# EAGLE design I2c Digipot (EAGLE 6.2)
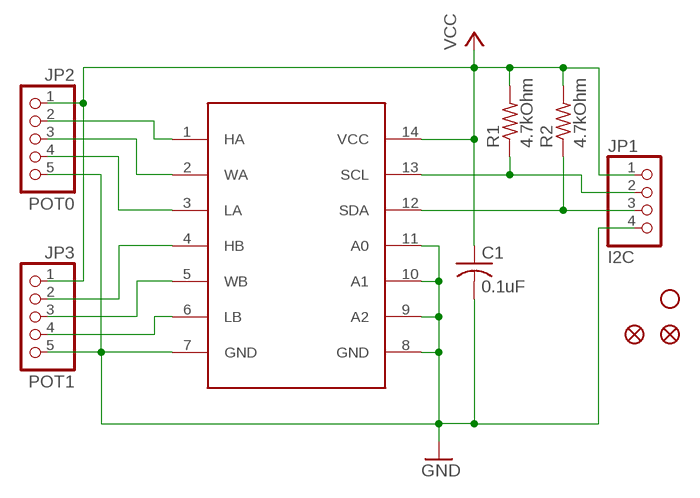
[diagram p0: schematic, sheet 1]

## Parts
C1  0.1uF  C-USC1206  [C1206]
JP1  I2C  PINHD-1X4  [1X04]
JP2  POT0  PINHD-1X5  [1X05]
JP3  POT1  PINHD-1X5  [1X05]
JP5  STAND-OFF  [STAND-OFF]
JP6  FIDUCIAL1X2  [FIDUCIAL-1X2]
JP7  FIDUCIAL1X2  [FIDUCIAL-1X2]
R1  4.7kOhm  R-US_R1206  [R1206]
R2  4.7kOhm  R-US_R1206  [R1206]
U1  MAX5387  [TSSOP14]

## Nets
GND: C1.2 JP1.4 JP2.5 JP3.5 U1.7(GND) U1.8(GND) U1.9(A2) U1.10(A1) U1.11(A0)
HA: JP2.2 U1.1(HA)
HB: JP3.2 U1.4(HB)
LA: JP2.4 U1.3(LA)
LB: JP3.4 U1.6(LB)
SCL: JP1.2 R1.1 U1.13(SCL)
SDA: JP1.3 R2.1 U1.12(SDA)
VCC: C1.1 JP1.1 JP2.1 JP3.1 R1.2 R2.2 U1.14(VCC)
WA: JP2.3 U1.2(WA)
WB: JP3.3 U1.5(WB)

## Library data of the parts
C1 = resistor:C-US: CAPACITOR, American symbol
JP1 = pinhead:PINHD-1X4: PIN HEADER
JP2 JP3 = pinhead:PINHD-1X5: PIN HEADER
JP5 = SparkFun:STAND-OFF: Stand Off This is the mechanical footprint for a #4 phillips button head screw. Use the keepout ring to avoid running the screw head into surrounding components. SKU : PRT-00447
JP6 JP7 = SparkFun:FIDUCIAL: Fiducial Alignment Points Various fiducial points for machine vision alignment.
R1 R2 = resistor:R-US_: RESISTOR, American symbol
U1 = logxen:MAX5387: Dual, 256-Tap, Volatile, Low-Voltage Linear Taper Digital Potentiometer

## Board
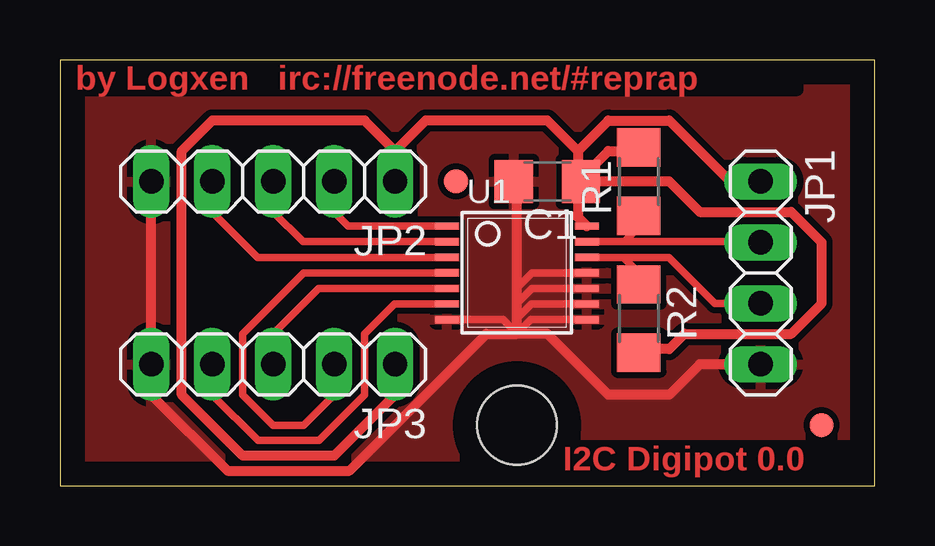
[diagram p1: board, top side]

Size 33.96 x 17.77 mm. Coordinates in mm from the lower left corner, seen from the top.
Outline: 0,0 33.96,0 33.96,17.77 0,17.77 0,0
Copper layers (1*16): Top 0.035mm / dielectric 1.5mm / Bottom 0.035mm
Design rules: minimum track width 10mil, minimum drill 24mil, track to track 8mil, track to pad 8mil, pad to pad 8mil, via to via 8mil, smd to smd 8mil, copper to edge 40mil, drill to drill 8mil, minimum pad ring 10mil, minimum via ring 8mil, stop-mask expansion 4mil, vias tented up to drill 0mil, thermal gap 10mil

### Footprints (pad centres in the part's own frame; a part is rotated, then mirrored left to right if it is on the bottom)
C1206 = smd 1.6 x 1.8: 1 -1.4,0; 2 1.4,0
1X04 = drill 1.016 long: 1 -3.81,0; 2 -1.27,0; 3 1.27,0; 4 3.81,0
1X05 = drill 1.016 long: 1 -5.08,0; 2 -2.54,0; 3 0,0; 4 2.54,0; 5 5.08,0
STAND-OFF = hole 3.302: 0,0
FIDUCIAL-1X2 = smd 1 x 1: 1 0,0
R1206 = smd 1.6 x 1.803: 1 -1.422,0; 2 1.422,0
TSSOP14 = smd 0.305 x 0.991: 1 -1.95,-2.918; 2 -1.3,-2.918; 3 -0.65,-2.918; 4 0,-2.918; 5 0.65,-2.918; 6 1.3,-2.918; 7 1.95,-2.918; 8 1.95,2.918; 9 1.3,2.918; 10 0.65,2.918; 11 0,2.918; 12 -0.65,2.918; 13 -1.3,2.918; 14 -1.95,2.918

### Placement (x,y rotation side)
C1  20.32,12.7 180 top
JP1  29.21,8.89 270 top
JP2  8.89,12.7 180 top
JP3  8.89,5.08 180 top
JP5  19.05,2.54 0 top
JP6  31.75,2.54 0 top
JP7  16.51,12.7 0 top
R1  24.13,12.7 90 top
R2  24.13,6.99 270 top
U1  19.05,8.89 270 top

### Tracks (layer width: path | path; a pad name or v marks a point on that pad's centre or on a via)
GND
  Top 0.305: U1.8 19.64,6.94 19.05,6.35 18.46,6.94 U1.7 | U1.9 19.66,7.59 19.05,6.99 | U1.10 19.67,8.24 19.05,7.62 | U1.11 19.68,8.89 19.05,8.26
  Top 0.406: 19.05,6.35 19.05,6.99 19.05,7.62 19.05,8.26 19.05,12.7 C1.2 | JP1.4 26.67,5.08 25.4,3.81 22.86,3.81 20.32,6.35 19.05,6.35 | JP2.5 JP3.5 3.81,3.81 6.99,0.64 12.06,0.64 17.78,6.35 19.05,6.35
  pour Top (isolate 0.254): 0.64,17.14 33.66,17.14 33.66,0.64 0.64,0.64
HA
  Top 0.305: U1.1 12.02,10.84 11.43,11.43 JP2.2
HB
  Top 0.305: U1.4 10.16,8.89 7.62,6.35 7.62,3.81 8.89,2.54 10.16,2.54 11.43,3.81 JP3.2
LA
  Top 0.305: U1.3 8.24,9.54 6.35,11.43 JP2.4
LB
  Top 0.305: U1.6 13.94,7.59 12.7,6.35 12.7,3.81 10.79,1.91 8.26,1.91 6.35,3.81 JP3.4
SCL
  Top 0.305: R1.1 24.13,10.79 23.52,10.19 U1.13 29.18,10.19 JP1.2
SDA
  Top 0.305: 23.48,9.54 25.39,9.54 27.3,7.62 JP1.3 | U1.12 23.48,9.54 | 23.48,9.54 24.13,8.89 R2.1
VCC
  Top 0.406: 21.59,12.7 21.59,11.22 U1.14 | 21.59,12.7 C1.1 | 21.59,13.97 20.32,15.24 15.24,15.24 13.97,13.97 | JP2.1 13.97,13.97 | 13.97,13.97 12.7,15.24 6.35,15.24 5.08,13.97 5.08,3.81 7.62,1.27 11.43,1.27 13.97,3.81 JP3.1 | JP1.1 27.94,12.7 25.4,15.24 22.86,15.24 21.59,13.97 | 22.23,13.34 22.23,13.21 C1.1 | 21.59,13.97 21.59,12.7 | 21.59,12.7 22.86,13.97 24.13,13.97 R1.2 | R2.2 24.13,5.71 25.4,5.71 26.04,6.35 30.48,6.35 31.75,7.62 31.75,10.16 30.48,11.43 26.67,11.43 25.4,12.7 C1.1
WA
  Top 0.305: U1.2 10.13,10.19 8.89,11.43 JP2.3
WB
  Top 0.305: U1.5 10.78,8.24 8.89,6.35 JP3.3

### Text on the board
Top: by Logxen irc://freenode.net/#reprap | I2C Digipot 0.0